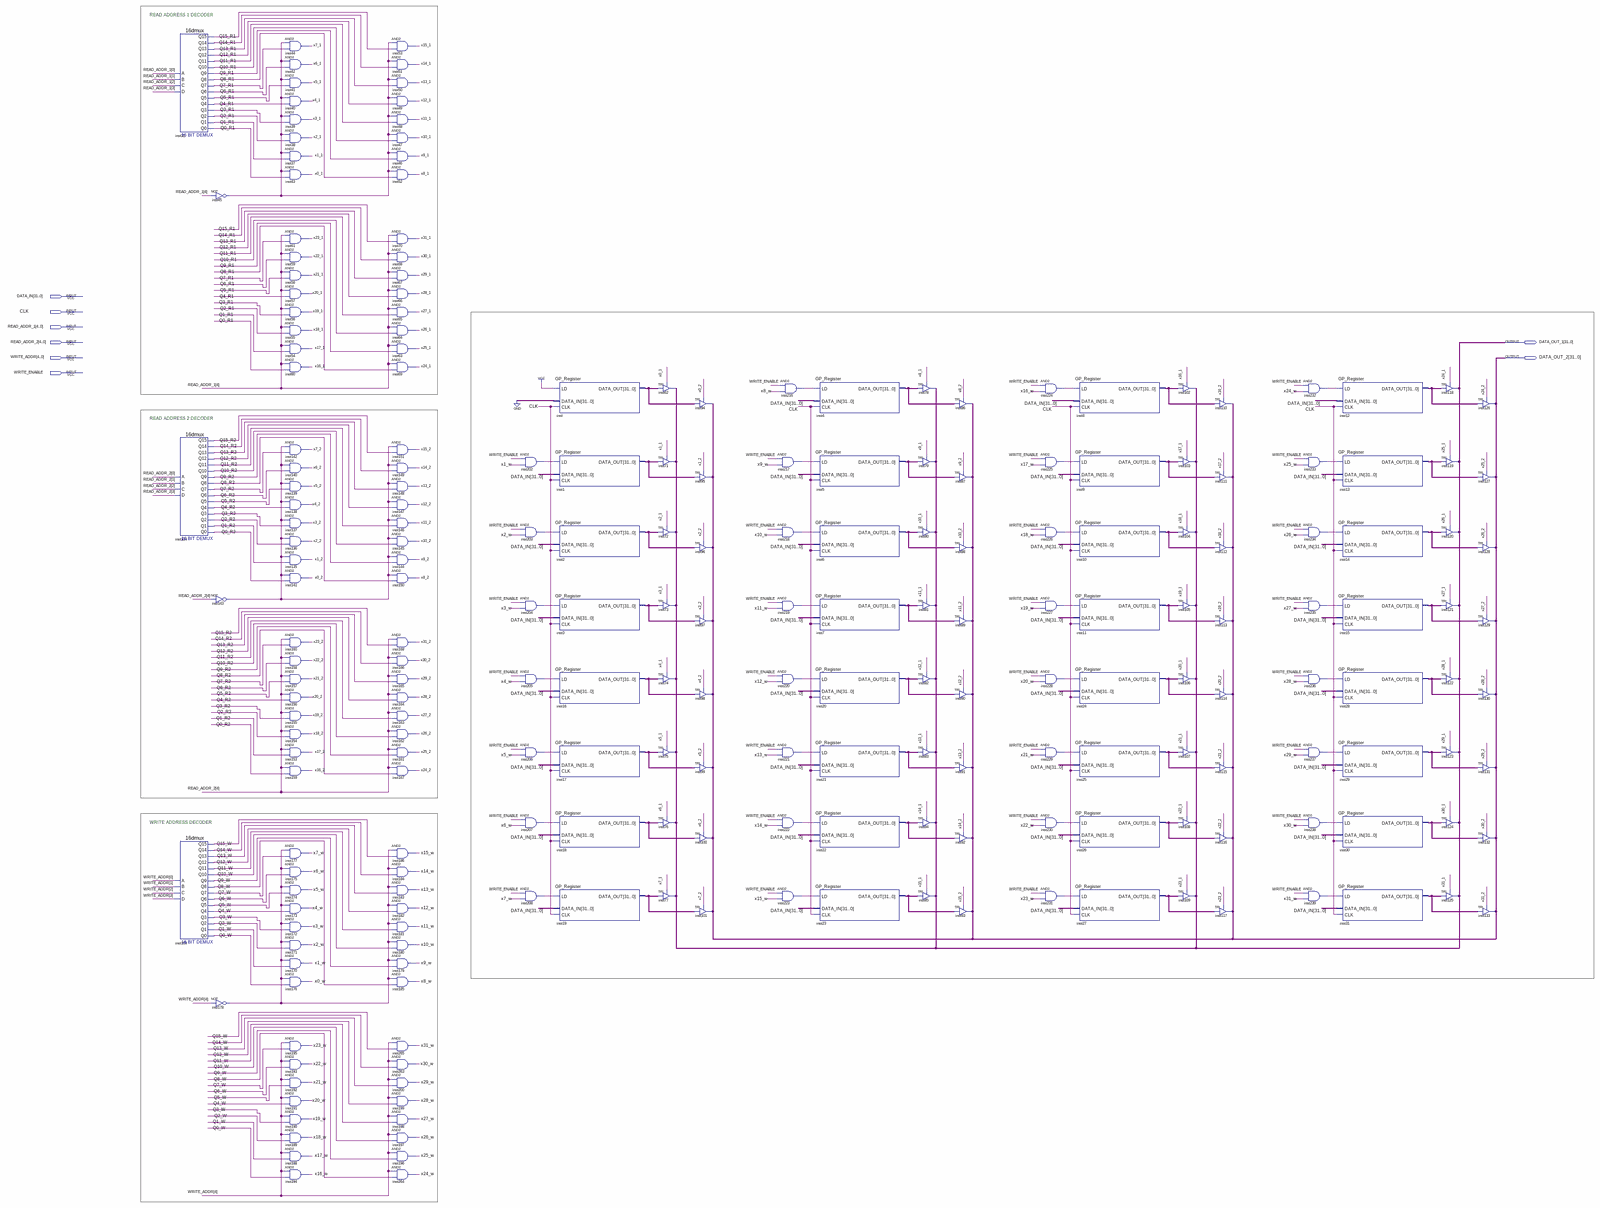
[diagram p0: schematic sheet, whole]
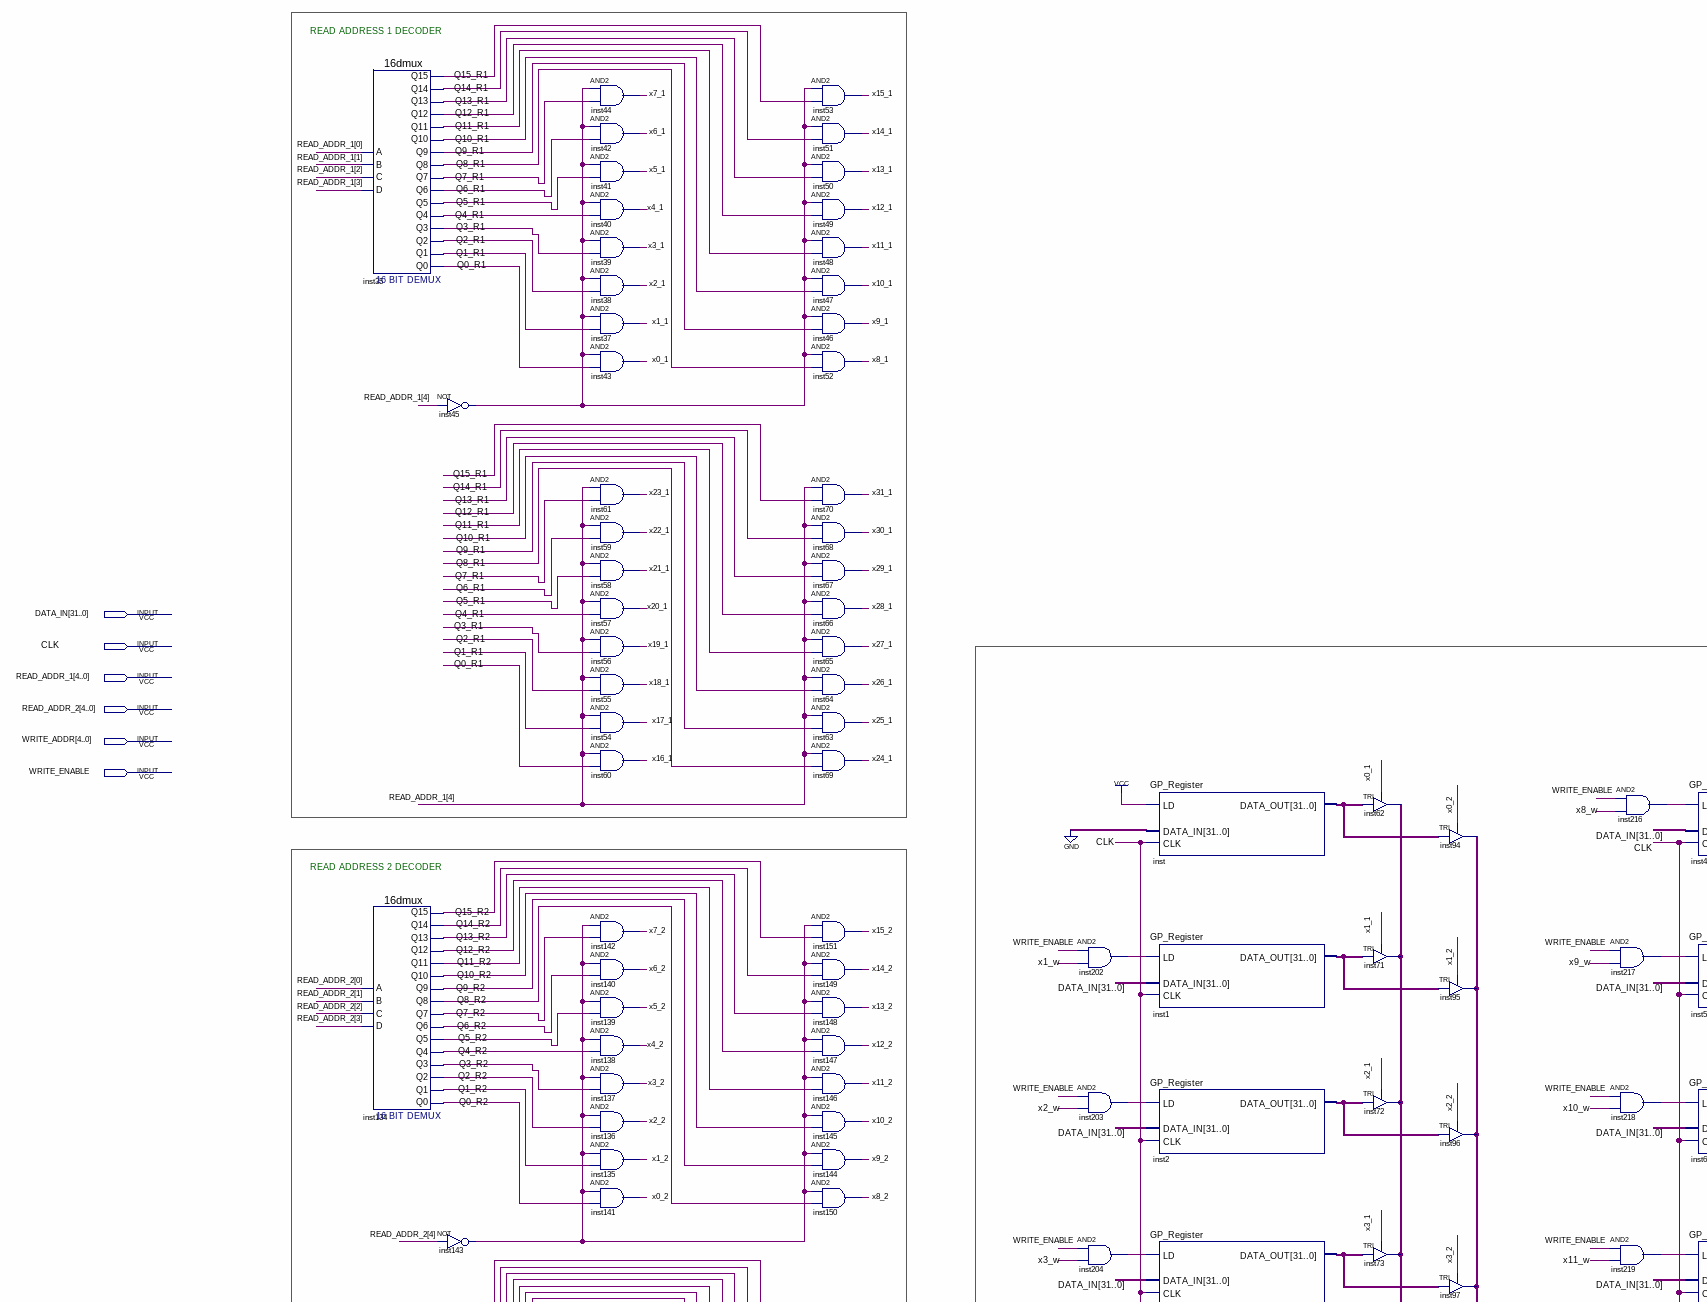
[diagram p1: schematic sheet, upper left part]
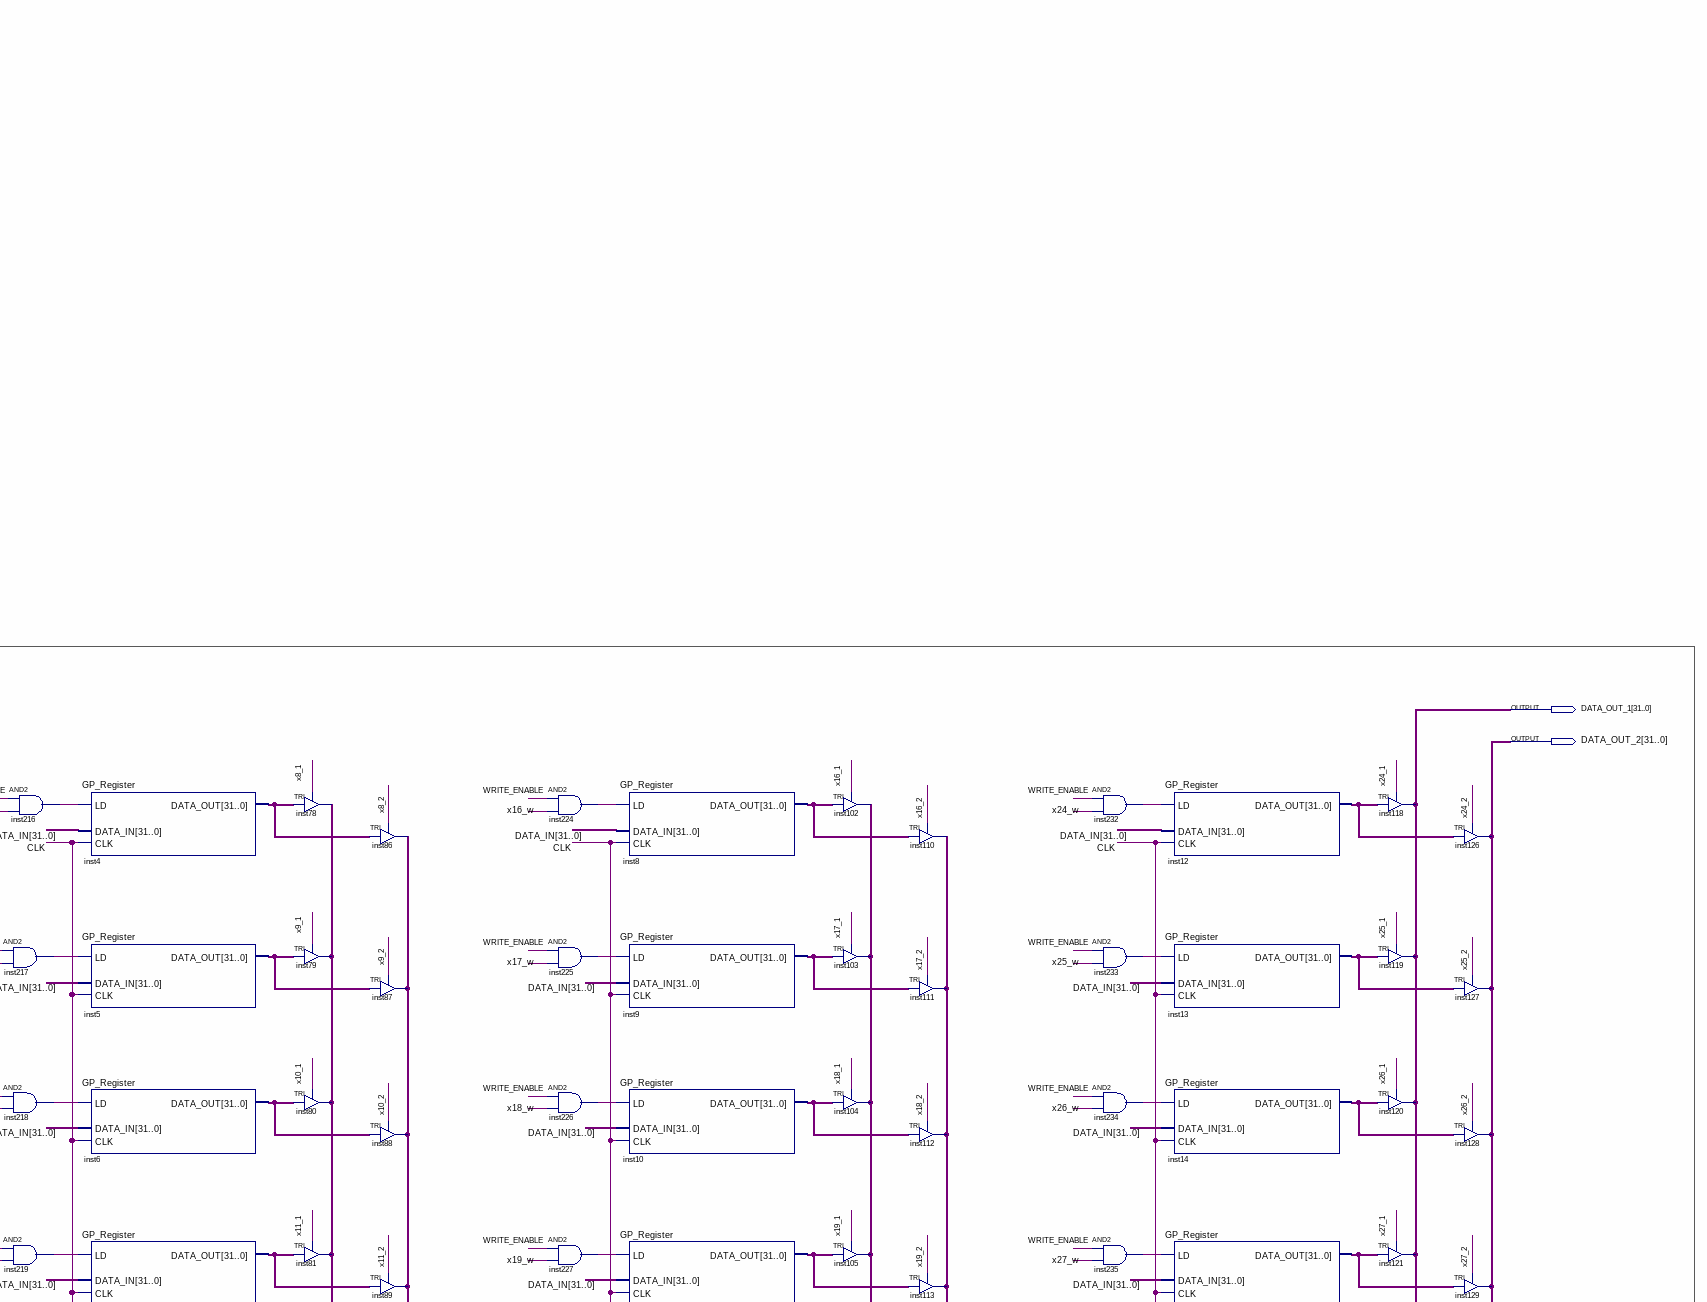
[diagram p2: schematic sheet, upper right part]
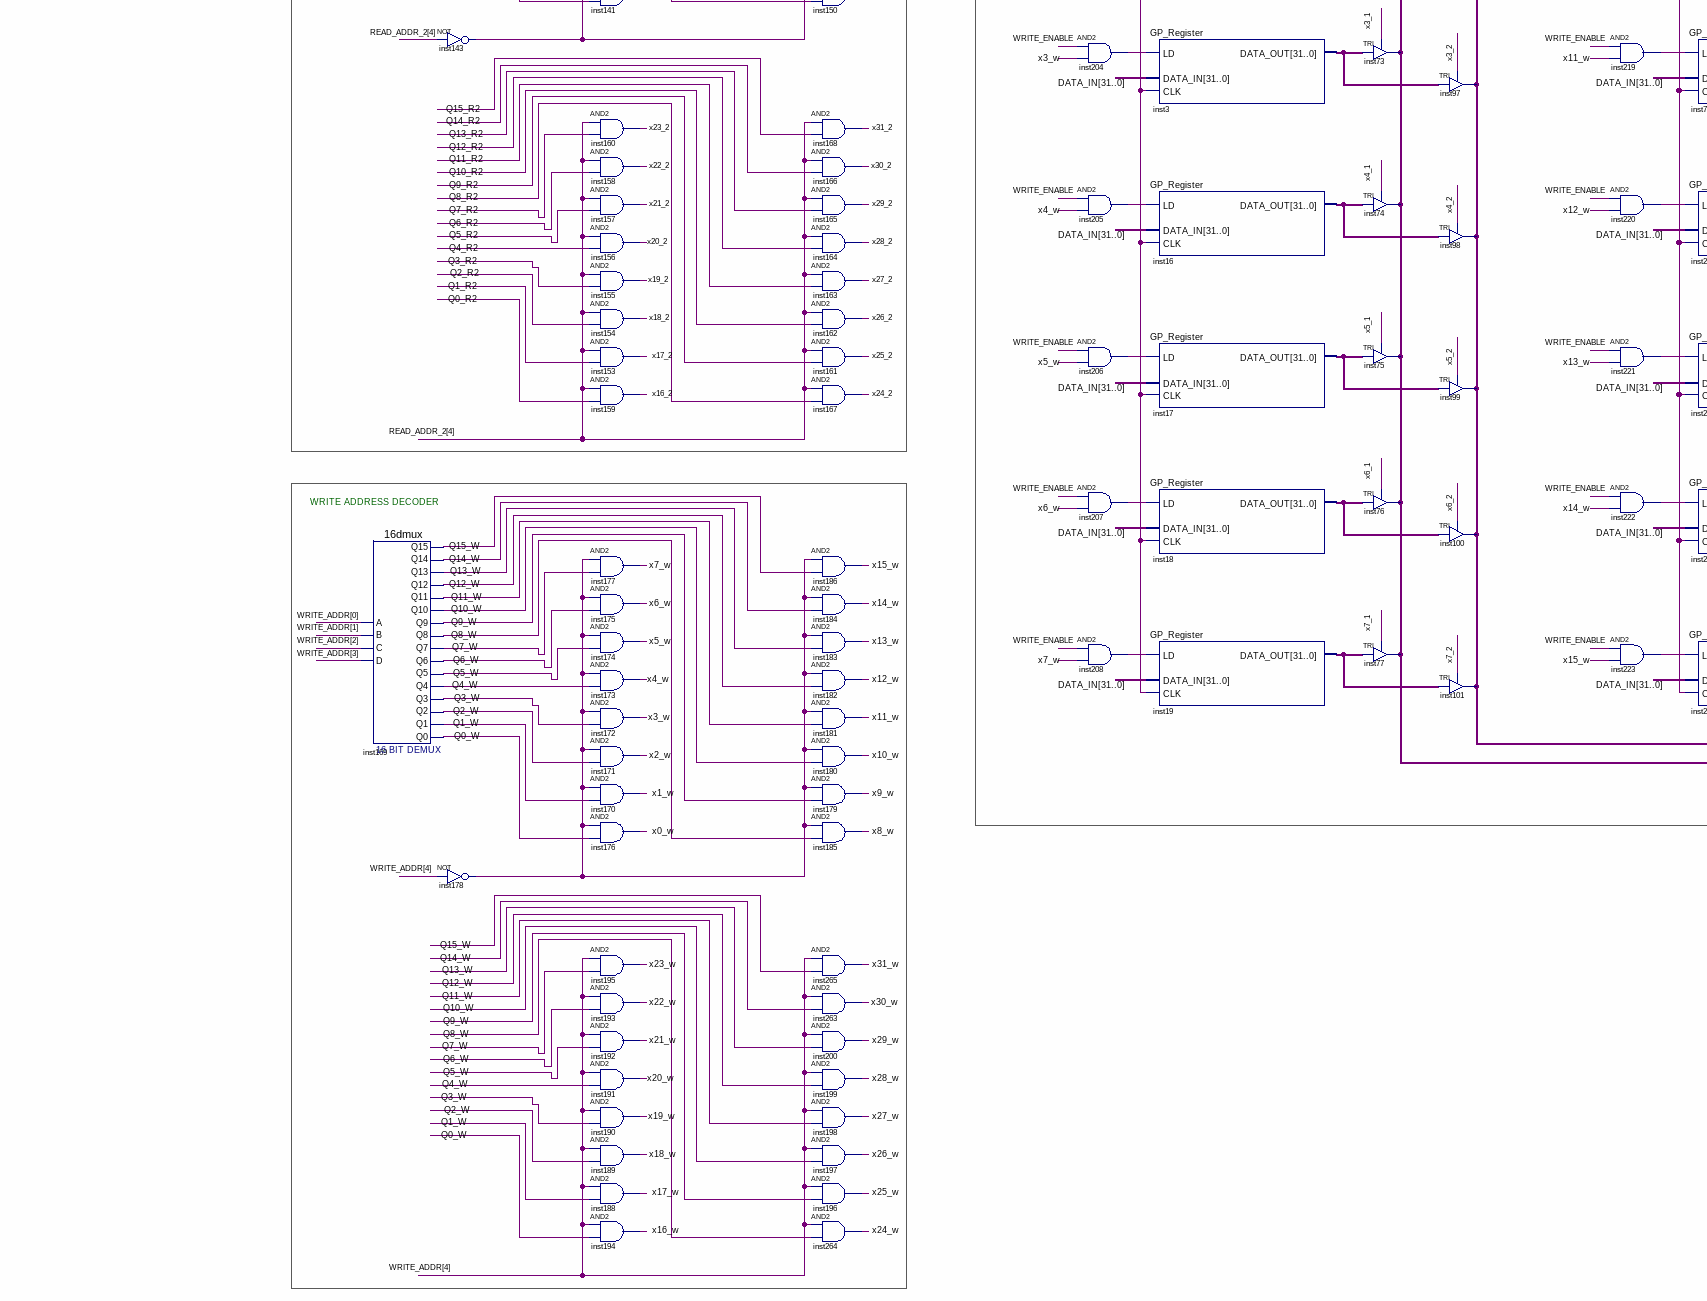
[diagram p3: schematic sheet, lower left part]
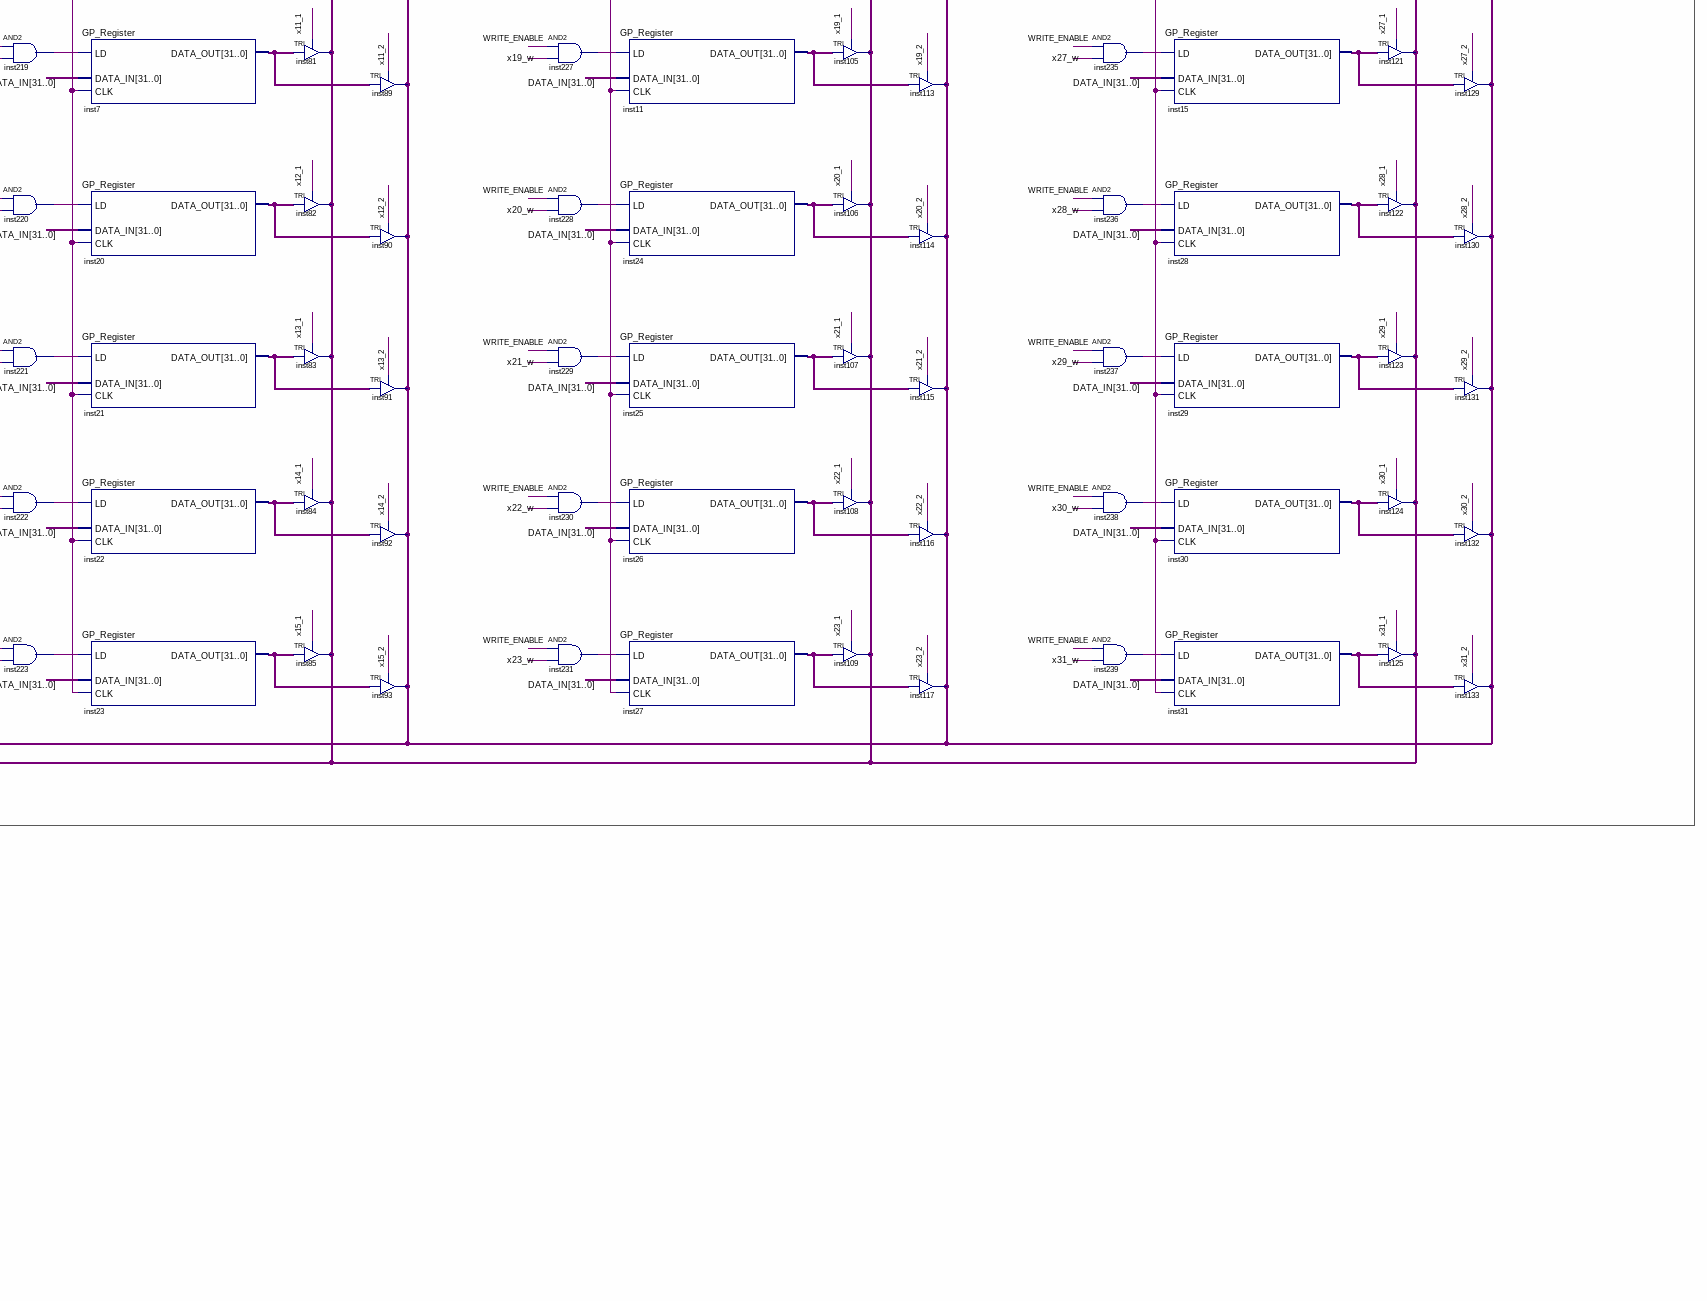
[diagram p4: schematic sheet, lower right part]
// Quartus schematic Register_File.bdf as structural Verilog: 229 symbols, 8 pins
module Register_File (
  input  [31:0] DATA_IN,
  input  CLK,
  input  [4:0] READ_ADDR_1,
  input  [4:0] READ_ADDR_2,
  input  [4:0] WRITE_ADDR,
  input  WRITE_ENABLE,
  output [31:0] DATA_OUT_1,
  output [31:0] DATA_OUT_2
);

  wire inst45_out, inst143_out, inst178_out, inst202_out, inst203_out, inst204_out, inst205_out, inst206_out,
       inst207_out, inst208_out, inst216_out, inst217_out, inst218_out, inst219_out, inst220_out,
       inst221_out, inst222_out, inst223_out, inst224_out, inst225_out, inst226_out, inst227_out,
       inst228_out, inst229_out, inst230_out, inst231_out, inst232_out, inst233_out, inst234_out,
       inst235_out, inst236_out, inst237_out, inst238_out, inst239_out, Q0_R1, Q0_R2, Q0_W, Q1_R1, Q1_R2,
       Q1_W, Q2_R1, Q2_R2, Q2_W, Q3_R1, Q3_R2, Q3_W, Q4_R1, Q4_R2, Q4_W, Q5_R1, Q5_R2, Q5_W, Q6_R1, Q6_R2,
       Q6_W, Q7_R1, Q7_R2, Q7_W, Q8_R1, Q8_R2, Q8_W, Q9_R1, Q9_R2, Q9_W, Q10_R1, Q10_R2, Q10_W, Q11_R1,
       Q11_R2, Q11_W, Q12_R1, Q12_R2, Q12_W, Q13_R1, Q13_R2, Q13_W, Q14_R1, Q14_R2, Q14_W, Q15_R1, Q15_R2,
       Q15_W, x0_1, x0_2, x0_w, x1_1, x1_2, x1_w, x2_1, x2_2, x2_w, x3_1, x3_2, x3_w, x4_1, x4_2, x4_w, x5_1,
       x5_2, x5_w, x6_1, x6_2, x6_w, x7_1, x7_2, x7_w, x8_1, x8_2, x8_w, x9_1, x9_2, x9_w, x10_1, x10_2,
       x10_w, x11_1, x11_2, x11_w, x12_1, x12_2, x12_w, x13_1, x13_2, x13_w, x14_1, x14_2, x14_w, x15_1,
       x15_2, x15_w, x16_1, x16_2, x16_w, x17_1, x17_2, x17_w, x18_1, x18_2, x18_w, x19_1, x19_2, x19_w,
       x20_1, x20_2, x20_w, x21_1, x21_2, x21_w, x22_1, x22_2, x22_w, x23_1, x23_2, x23_w, x24_1, x24_2,
       x24_w, x25_1, x25_2, x25_w, x26_1, x26_2, x26_w, x27_1, x27_2, x27_w, x28_1, x28_2, x28_w, x29_1,
       x29_2, x29_w, x30_1, x30_2, x30_w, x31_1, x31_2, x31_w;
  wire [31:0] inst1_data_out, inst2_data_out, inst3_data_out, inst4_data_out, inst5_data_out, inst6_data_out,
       inst7_data_out, inst8_data_out, inst9_data_out, inst10_data_out, inst11_data_out, inst12_data_out,
       inst13_data_out, inst14_data_out, inst15_data_out, inst16_data_out, inst17_data_out, inst18_data_out,
       inst19_data_out, inst20_data_out, inst21_data_out, inst22_data_out, inst23_data_out, inst24_data_out,
       inst25_data_out, inst26_data_out, inst27_data_out, inst28_data_out, inst29_data_out, inst30_data_out,
       inst31_data_out, inst_data_out;

  \16dmux  inst35 (
    .C(READ_ADDR_1[2]), .B(READ_ADDR_1[1]), .A(READ_ADDR_1[0]), .D(READ_ADDR_1[3]), .Q12(Q12_R1),
    .Q13(Q13_R1), .Q11(Q11_R1), .Q9(Q9_R1), .Q10(Q10_R1), .Q7(Q7_R1), .Q8(Q8_R1), .Q4(Q4_R1), .Q5(Q5_R1),
    .Q6(Q6_R1), .Q2(Q2_R1), .Q3(Q3_R1), .Q14(Q14_R1), .Q15(Q15_R1), .Q0(Q0_R1), .Q1(Q1_R1));
  \16dmux  inst134 (
    .C(READ_ADDR_2[2]), .B(READ_ADDR_2[1]), .A(READ_ADDR_2[0]), .D(READ_ADDR_2[3]), .Q12(Q12_R2),
    .Q13(Q13_R2), .Q11(Q11_R2), .Q9(Q9_R2), .Q10(Q10_R2), .Q7(Q7_R2), .Q8(Q8_R2), .Q4(Q4_R2), .Q5(Q5_R2),
    .Q6(Q6_R2), .Q2(Q2_R2), .Q3(Q3_R2), .Q14(Q14_R2), .Q15(Q15_R2), .Q0(Q0_R2), .Q1(Q1_R2));
  \16dmux  inst169 (
    .C(WRITE_ADDR[2]), .B(WRITE_ADDR[1]), .A(WRITE_ADDR[0]), .D(WRITE_ADDR[3]), .Q12(Q12_W), .Q13(Q13_W),
    .Q11(Q11_W), .Q9(Q9_W), .Q10(Q10_W), .Q7(Q7_W), .Q8(Q8_W), .Q4(Q4_W), .Q5(Q5_W), .Q6(Q6_W), .Q2(Q2_W),
    .Q3(Q3_W), .Q14(Q14_W), .Q15(Q15_W), .Q0(Q0_W), .Q1(Q1_W));
  not inst45 (inst45_out, READ_ADDR_1[4]);
  not inst143 (inst143_out, READ_ADDR_2[4]);
  not inst178 (inst178_out, WRITE_ADDR[4]);
  and inst44 (x7_1, inst45_out, Q7_R1);
  and inst42 (x6_1, inst45_out, Q6_R1);
  and inst41 (x5_1, inst45_out, Q5_R1);
  and inst40 (x4_1, inst45_out, Q4_R1);
  and inst39 (x3_1, inst45_out, Q3_R1);
  and inst38 (x2_1, inst45_out, Q2_R1);
  and inst37 (x1_1, inst45_out, Q1_R1);
  and inst43 (x0_1, inst45_out, Q0_R1);
  and inst61 (x23_1, READ_ADDR_1[4], Q7_R1);
  and inst59 (x22_1, READ_ADDR_1[4], Q6_R1);
  and inst58 (x21_1, READ_ADDR_1[4], Q5_R1);
  and inst57 (x20_1, READ_ADDR_1[4], Q4_R1);
  and inst56 (x19_1, READ_ADDR_1[4], Q3_R1);
  and inst55 (x18_1, READ_ADDR_1[4], Q2_R1);
  and inst54 (x17_1, READ_ADDR_1[4], Q1_R1);
  and inst60 (x16_1, READ_ADDR_1[4], Q0_R1);
  and inst142 (x7_2, inst143_out, Q7_R2);
  and inst140 (x6_2, inst143_out, Q6_R2);
  and inst139 (x5_2, inst143_out, Q5_R2);
  and inst138 (x4_2, inst143_out, Q4_R2);
  and inst137 (x3_2, inst143_out, Q3_R2);
  and inst136 (x2_2, inst143_out, Q2_R2);
  and inst135 (x1_2, inst143_out, Q1_R2);
  and inst141 (x0_2, inst143_out, Q0_R2);
  and inst160 (x23_2, READ_ADDR_2[4], Q7_R2);
  and inst158 (x22_2, READ_ADDR_2[4], Q6_R2);
  and inst157 (x21_2, READ_ADDR_2[4], Q5_R2);
  and inst156 (x20_2, READ_ADDR_2[4], Q4_R2);
  and inst155 (x19_2, READ_ADDR_2[4], Q3_R2);
  and inst154 (x18_2, READ_ADDR_2[4], Q2_R2);
  and inst153 (x17_2, READ_ADDR_2[4], Q1_R2);
  and inst159 (x16_2, READ_ADDR_2[4], Q0_R2);
  and inst177 (x7_w, inst178_out, Q7_W);
  and inst175 (x6_w, inst178_out, Q6_W);
  and inst174 (x5_w, inst178_out, Q5_W);
  and inst173 (x4_w, inst178_out, Q4_W);
  and inst172 (x3_w, inst178_out, Q3_W);
  and inst171 (x2_w, inst178_out, Q2_W);
  and inst170 (x1_w, inst178_out, Q1_W);
  and inst176 (x0_w, inst178_out, Q0_W);
  and inst195 (x23_w, WRITE_ADDR[4], Q7_W);
  and inst193 (x22_w, WRITE_ADDR[4], Q6_W);
  and inst192 (x21_w, WRITE_ADDR[4], Q5_W);
  and inst191 (x20_w, WRITE_ADDR[4], Q4_W);
  and inst190 (x19_w, WRITE_ADDR[4], Q3_W);
  and inst189 (x18_w, WRITE_ADDR[4], Q2_W);
  and inst188 (x17_w, WRITE_ADDR[4], Q1_W);
  and inst194 (x16_w, WRITE_ADDR[4], Q0_W);
  and inst53 (x15_1, inst45_out, Q15_R1);
  and inst51 (x14_1, inst45_out, Q14_R1);
  and inst50 (x13_1, inst45_out, Q13_R1);
  and inst49 (x12_1, inst45_out, Q12_R1);
  and inst48 (x11_1, inst45_out, Q11_R1);
  and inst47 (x10_1, inst45_out, Q10_R1);
  and inst46 (x9_1, inst45_out, Q9_R1);
  and inst52 (x8_1, inst45_out, Q8_R1);
  and inst70 (x31_1, READ_ADDR_1[4], Q15_R1);
  and inst68 (x30_1, READ_ADDR_1[4], Q14_R1);
  and inst67 (x29_1, READ_ADDR_1[4], Q13_R1);
  and inst66 (x28_1, READ_ADDR_1[4], Q12_R1);
  and inst65 (x27_1, READ_ADDR_1[4], Q11_R1);
  and inst64 (x26_1, READ_ADDR_1[4], Q10_R1);
  and inst63 (x25_1, READ_ADDR_1[4], Q9_R1);
  and inst69 (x24_1, READ_ADDR_1[4], Q8_R1);
  and inst151 (x15_2, inst143_out, Q15_R2);
  and inst149 (x14_2, inst143_out, Q14_R2);
  and inst148 (x13_2, inst143_out, Q13_R2);
  and inst147 (x12_2, inst143_out, Q12_R2);
  and inst146 (x11_2, inst143_out, Q11_R2);
  and inst145 (x10_2, inst143_out, Q10_R2);
  and inst144 (x9_2, inst143_out, Q9_R2);
  and inst150 (x8_2, inst143_out, Q8_R2);
  and inst168 (x31_2, READ_ADDR_2[4], Q15_R2);
  and inst166 (x30_2, READ_ADDR_2[4], Q14_R2);
  and inst165 (x29_2, READ_ADDR_2[4], Q13_R2);
  and inst164 (x28_2, READ_ADDR_2[4], Q12_R2);
  and inst163 (x27_2, READ_ADDR_2[4], Q11_R2);
  and inst162 (x26_2, READ_ADDR_2[4], Q10_R2);
  and inst161 (x25_2, READ_ADDR_2[4], Q9_R2);
  and inst167 (x24_2, READ_ADDR_2[4], Q8_R2);
  and inst186 (x15_w, inst178_out, Q15_W);
  and inst184 (x14_w, inst178_out, Q14_W);
  and inst183 (x13_w, inst178_out, Q13_W);
  and inst182 (x12_w, inst178_out, Q12_W);
  and inst181 (x11_w, inst178_out, Q11_W);
  and inst180 (x10_w, inst178_out, Q10_W);
  and inst179 (x9_w, inst178_out, Q9_W);
  and inst185 (x8_w, inst178_out, Q8_W);
  and inst265 (x31_w, WRITE_ADDR[4], Q15_W);
  and inst263 (x30_w, WRITE_ADDR[4], Q14_W);
  and inst200 (x29_w, WRITE_ADDR[4], Q13_W);
  and inst199 (x28_w, WRITE_ADDR[4], Q12_W);
  and inst198 (x27_w, WRITE_ADDR[4], Q11_W);
  and inst197 (x26_w, WRITE_ADDR[4], Q10_W);
  and inst196 (x25_w, WRITE_ADDR[4], Q9_W);
  and inst264 (x24_w, WRITE_ADDR[4], Q8_W);
  and inst202 (inst202_out, WRITE_ENABLE, x1_w);
  and inst203 (inst203_out, WRITE_ENABLE, x2_w);
  and inst204 (inst204_out, WRITE_ENABLE, x3_w);
  and inst205 (inst205_out, WRITE_ENABLE, x4_w);
  and inst206 (inst206_out, WRITE_ENABLE, x5_w);
  and inst207 (inst207_out, WRITE_ENABLE, x6_w);
  and inst208 (inst208_out, WRITE_ENABLE, x7_w);
  GP_Register inst (.LD(1'b1), .DATA_IN({32{1'b0}}), .CLK(CLK), .DATA_OUT(inst_data_out));
  GP_Register inst1 (.LD(inst202_out), .DATA_IN(DATA_IN), .CLK(CLK), .DATA_OUT(inst1_data_out));
  GP_Register inst2 (.LD(inst203_out), .DATA_IN(DATA_IN), .CLK(CLK), .DATA_OUT(inst2_data_out));
  GP_Register inst3 (.LD(inst204_out), .DATA_IN(DATA_IN), .CLK(CLK), .DATA_OUT(inst3_data_out));
  GP_Register inst16 (.LD(inst205_out), .DATA_IN(DATA_IN), .CLK(CLK), .DATA_OUT(inst16_data_out));
  GP_Register inst17 (.LD(inst206_out), .DATA_IN(DATA_IN), .CLK(CLK), .DATA_OUT(inst17_data_out));
  GP_Register inst18 (.LD(inst207_out), .DATA_IN(DATA_IN), .CLK(CLK), .DATA_OUT(inst18_data_out));
  GP_Register inst19 (.LD(inst208_out), .DATA_IN(DATA_IN), .CLK(CLK), .DATA_OUT(inst19_data_out));
  TRI inst62[31:0] (.IN(inst_data_out), .OE(x0_1), .OUT(DATA_OUT_1));
  TRI inst71[31:0] (.IN(inst1_data_out), .OE(x1_1), .OUT(DATA_OUT_1));
  TRI inst72[31:0] (.IN(inst2_data_out), .OE(x2_1), .OUT(DATA_OUT_1));
  TRI inst73[31:0] (.IN(inst3_data_out), .OE(x3_1), .OUT(DATA_OUT_1));
  TRI inst74[31:0] (.IN(inst16_data_out), .OE(x4_1), .OUT(DATA_OUT_1));
  TRI inst75[31:0] (.IN(inst17_data_out), .OE(x5_1), .OUT(DATA_OUT_1));
  TRI inst76[31:0] (.IN(inst18_data_out), .OE(x6_1), .OUT(DATA_OUT_1));
  TRI inst77[31:0] (.IN(inst19_data_out), .OE(x7_1), .OUT(DATA_OUT_1));
  TRI inst94[31:0] (.IN(inst_data_out), .OE(x0_2), .OUT(DATA_OUT_2));
  TRI inst95[31:0] (.IN(inst1_data_out), .OE(x1_2), .OUT(DATA_OUT_2));
  TRI inst96[31:0] (.IN(inst2_data_out), .OE(x2_2), .OUT(DATA_OUT_2));
  TRI inst97[31:0] (.IN(inst3_data_out), .OE(x3_2), .OUT(DATA_OUT_2));
  TRI inst98[31:0] (.IN(inst16_data_out), .OE(x4_2), .OUT(DATA_OUT_2));
  TRI inst99[31:0] (.IN(inst17_data_out), .OE(x5_2), .OUT(DATA_OUT_2));
  TRI inst100[31:0] (.IN(inst18_data_out), .OE(x6_2), .OUT(DATA_OUT_2));
  TRI inst101[31:0] (.IN(inst19_data_out), .OE(x7_2), .OUT(DATA_OUT_2));
  and inst216 (inst216_out, WRITE_ENABLE, x8_w);
  and inst217 (inst217_out, WRITE_ENABLE, x9_w);
  and inst218 (inst218_out, WRITE_ENABLE, x10_w);
  and inst219 (inst219_out, WRITE_ENABLE, x11_w);
  and inst220 (inst220_out, WRITE_ENABLE, x12_w);
  and inst221 (inst221_out, WRITE_ENABLE, x13_w);
  and inst222 (inst222_out, WRITE_ENABLE, x14_w);
  and inst223 (inst223_out, WRITE_ENABLE, x15_w);
  GP_Register inst4 (.LD(inst216_out), .DATA_IN(DATA_IN), .CLK(CLK), .DATA_OUT(inst4_data_out));
  GP_Register inst5 (.LD(inst217_out), .DATA_IN(DATA_IN), .CLK(CLK), .DATA_OUT(inst5_data_out));
  GP_Register inst6 (.LD(inst218_out), .DATA_IN(DATA_IN), .CLK(CLK), .DATA_OUT(inst6_data_out));
  GP_Register inst7 (.LD(inst219_out), .DATA_IN(DATA_IN), .CLK(CLK), .DATA_OUT(inst7_data_out));
  GP_Register inst20 (.LD(inst220_out), .DATA_IN(DATA_IN), .CLK(CLK), .DATA_OUT(inst20_data_out));
  GP_Register inst21 (.LD(inst221_out), .DATA_IN(DATA_IN), .CLK(CLK), .DATA_OUT(inst21_data_out));
  GP_Register inst22 (.LD(inst222_out), .DATA_IN(DATA_IN), .CLK(CLK), .DATA_OUT(inst22_data_out));
  GP_Register inst23 (.LD(inst223_out), .DATA_IN(DATA_IN), .CLK(CLK), .DATA_OUT(inst23_data_out));
  TRI inst78[31:0] (.IN(inst4_data_out), .OE(x8_1), .OUT(DATA_OUT_1));
  TRI inst79[31:0] (.IN(inst5_data_out), .OE(x9_1), .OUT(DATA_OUT_1));
  TRI inst80[31:0] (.IN(inst6_data_out), .OE(x10_1), .OUT(DATA_OUT_1));
  TRI inst81[31:0] (.IN(inst7_data_out), .OE(x11_1), .OUT(DATA_OUT_1));
  TRI inst82[31:0] (.IN(inst20_data_out), .OE(x12_1), .OUT(DATA_OUT_1));
  TRI inst83[31:0] (.IN(inst21_data_out), .OE(x13_1), .OUT(DATA_OUT_1));
  TRI inst84[31:0] (.IN(inst22_data_out), .OE(x14_1), .OUT(DATA_OUT_1));
  TRI inst85[31:0] (.IN(inst23_data_out), .OE(x15_1), .OUT(DATA_OUT_1));
  TRI inst86[31:0] (.IN(inst4_data_out), .OE(x8_2), .OUT(DATA_OUT_2));
  TRI inst87[31:0] (.IN(inst5_data_out), .OE(x9_2), .OUT(DATA_OUT_2));
  TRI inst88[31:0] (.IN(inst6_data_out), .OE(x10_2), .OUT(DATA_OUT_2));
  TRI inst89[31:0] (.IN(inst7_data_out), .OE(x11_2), .OUT(DATA_OUT_2));
  TRI inst90[31:0] (.IN(inst20_data_out), .OE(x12_2), .OUT(DATA_OUT_2));
  TRI inst91[31:0] (.IN(inst21_data_out), .OE(x13_2), .OUT(DATA_OUT_2));
  TRI inst92[31:0] (.IN(inst22_data_out), .OE(x14_2), .OUT(DATA_OUT_2));
  TRI inst93[31:0] (.IN(inst23_data_out), .OE(x15_2), .OUT(DATA_OUT_2));
  and inst224 (inst224_out, WRITE_ENABLE, x16_w);
  and inst225 (inst225_out, WRITE_ENABLE, x17_w);
  and inst226 (inst226_out, WRITE_ENABLE, x18_w);
  and inst227 (inst227_out, WRITE_ENABLE, x19_w);
  and inst228 (inst228_out, WRITE_ENABLE, x20_w);
  and inst229 (inst229_out, WRITE_ENABLE, x21_w);
  and inst230 (inst230_out, WRITE_ENABLE, x22_w);
  and inst231 (inst231_out, WRITE_ENABLE, x23_w);
  GP_Register inst8 (.LD(inst224_out), .DATA_IN(DATA_IN), .CLK(CLK), .DATA_OUT(inst8_data_out));
  GP_Register inst9 (.LD(inst225_out), .DATA_IN(DATA_IN), .CLK(CLK), .DATA_OUT(inst9_data_out));
  GP_Register inst10 (.LD(inst226_out), .DATA_IN(DATA_IN), .CLK(CLK), .DATA_OUT(inst10_data_out));
  GP_Register inst11 (.LD(inst227_out), .DATA_IN(DATA_IN), .CLK(CLK), .DATA_OUT(inst11_data_out));
  GP_Register inst24 (.LD(inst228_out), .DATA_IN(DATA_IN), .CLK(CLK), .DATA_OUT(inst24_data_out));
  GP_Register inst25 (.LD(inst229_out), .DATA_IN(DATA_IN), .CLK(CLK), .DATA_OUT(inst25_data_out));
  GP_Register inst26 (.LD(inst230_out), .DATA_IN(DATA_IN), .CLK(CLK), .DATA_OUT(inst26_data_out));
  GP_Register inst27 (.LD(inst231_out), .DATA_IN(DATA_IN), .CLK(CLK), .DATA_OUT(inst27_data_out));
  TRI inst102[31:0] (.IN(inst8_data_out), .OE(x16_1), .OUT(DATA_OUT_1));
  TRI inst103[31:0] (.IN(inst9_data_out), .OE(x17_1), .OUT(DATA_OUT_1));
  TRI inst104[31:0] (.IN(inst10_data_out), .OE(x18_1), .OUT(DATA_OUT_1));
  TRI inst105[31:0] (.IN(inst11_data_out), .OE(x19_1), .OUT(DATA_OUT_1));
  TRI inst106[31:0] (.IN(inst24_data_out), .OE(x20_1), .OUT(DATA_OUT_1));
  TRI inst107[31:0] (.IN(inst25_data_out), .OE(x21_1), .OUT(DATA_OUT_1));
  TRI inst108[31:0] (.IN(inst26_data_out), .OE(x22_1), .OUT(DATA_OUT_1));
  TRI inst109[31:0] (.IN(inst27_data_out), .OE(x23_1), .OUT(DATA_OUT_1));
  TRI inst110[31:0] (.IN(inst8_data_out), .OE(x16_2), .OUT(DATA_OUT_2));
  TRI inst111[31:0] (.IN(inst9_data_out), .OE(x17_2), .OUT(DATA_OUT_2));
  TRI inst112[31:0] (.IN(inst10_data_out), .OE(x18_2), .OUT(DATA_OUT_2));
  TRI inst113[31:0] (.IN(inst11_data_out), .OE(x19_2), .OUT(DATA_OUT_2));
  TRI inst114[31:0] (.IN(inst24_data_out), .OE(x20_2), .OUT(DATA_OUT_2));
  TRI inst115[31:0] (.IN(inst25_data_out), .OE(x21_2), .OUT(DATA_OUT_2));
  TRI inst116[31:0] (.IN(inst26_data_out), .OE(x22_2), .OUT(DATA_OUT_2));
  TRI inst117[31:0] (.IN(inst27_data_out), .OE(x23_2), .OUT(DATA_OUT_2));
  and inst232 (inst232_out, WRITE_ENABLE, x24_w);
  and inst233 (inst233_out, WRITE_ENABLE, x25_w);
  and inst234 (inst234_out, WRITE_ENABLE, x26_w);
  and inst235 (inst235_out, WRITE_ENABLE, x27_w);
  and inst236 (inst236_out, WRITE_ENABLE, x28_w);
  and inst237 (inst237_out, WRITE_ENABLE, x29_w);
  and inst238 (inst238_out, WRITE_ENABLE, x30_w);
  and inst239 (inst239_out, WRITE_ENABLE, x31_w);
  GP_Register inst12 (.LD(inst232_out), .DATA_IN(DATA_IN), .CLK(CLK), .DATA_OUT(inst12_data_out));
  GP_Register inst13 (.LD(inst233_out), .DATA_IN(DATA_IN), .CLK(CLK), .DATA_OUT(inst13_data_out));
  GP_Register inst14 (.LD(inst234_out), .DATA_IN(DATA_IN), .CLK(CLK), .DATA_OUT(inst14_data_out));
  GP_Register inst15 (.LD(inst235_out), .DATA_IN(DATA_IN), .CLK(CLK), .DATA_OUT(inst15_data_out));
  GP_Register inst28 (.LD(inst236_out), .DATA_IN(DATA_IN), .CLK(CLK), .DATA_OUT(inst28_data_out));
  GP_Register inst29 (.LD(inst237_out), .DATA_IN(DATA_IN), .CLK(CLK), .DATA_OUT(inst29_data_out));
  GP_Register inst30 (.LD(inst238_out), .DATA_IN(DATA_IN), .CLK(CLK), .DATA_OUT(inst30_data_out));
  GP_Register inst31 (.LD(inst239_out), .DATA_IN(DATA_IN), .CLK(CLK), .DATA_OUT(inst31_data_out));
  TRI inst118[31:0] (.IN(inst12_data_out), .OE(x24_1), .OUT(DATA_OUT_1));
  TRI inst119[31:0] (.IN(inst13_data_out), .OE(x25_1), .OUT(DATA_OUT_1));
  TRI inst120[31:0] (.IN(inst14_data_out), .OE(x26_1), .OUT(DATA_OUT_1));
  TRI inst121[31:0] (.IN(inst15_data_out), .OE(x27_1), .OUT(DATA_OUT_1));
  TRI inst122[31:0] (.IN(inst28_data_out), .OE(x28_1), .OUT(DATA_OUT_1));
  TRI inst123[31:0] (.IN(inst29_data_out), .OE(x29_1), .OUT(DATA_OUT_1));
  TRI inst124[31:0] (.IN(inst30_data_out), .OE(x30_1), .OUT(DATA_OUT_1));
  TRI inst125[31:0] (.IN(inst31_data_out), .OE(x31_1), .OUT(DATA_OUT_1));
  TRI inst126[31:0] (.IN(inst12_data_out), .OE(x24_2), .OUT(DATA_OUT_2));
  TRI inst127[31:0] (.IN(inst13_data_out), .OE(x25_2), .OUT(DATA_OUT_2));
  TRI inst128[31:0] (.IN(inst14_data_out), .OE(x26_2), .OUT(DATA_OUT_2));
  TRI inst129[31:0] (.IN(inst15_data_out), .OE(x27_2), .OUT(DATA_OUT_2));
  TRI inst130[31:0] (.IN(inst28_data_out), .OE(x28_2), .OUT(DATA_OUT_2));
  TRI inst131[31:0] (.IN(inst29_data_out), .OE(x29_2), .OUT(DATA_OUT_2));
  TRI inst132[31:0] (.IN(inst30_data_out), .OE(x30_2), .OUT(DATA_OUT_2));
  TRI inst133[31:0] (.IN(inst31_data_out), .OE(x31_2), .OUT(DATA_OUT_2));

  // Notes on the sheet:
  //   READ ADDRESS 1 DECODER
  //   READ ADDRESS 2 DECODER
  //   WRITE ADDRESS DECODER
endmodule
